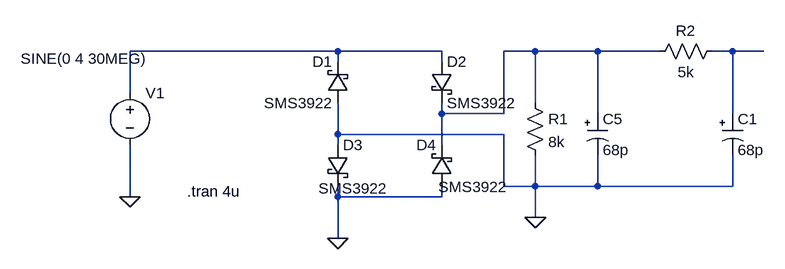
[diagram p0: schematic SQRL_Resonator_Full_Wave_Bridge_Rectifier_RF_Diode.asc]
SQRL_Resonator_Full_Wave_Bridge_Rectifier_RF_Diode.asc, the LTspice schematic file:
Version 4
SHEET 1 1288 680
WIRE 624 32 304 32
WIRE 784 32 624 32
WIRE 928 32 880 32
WIRE 1024 32 928 32
WIRE 1120 32 1024 32
WIRE 1232 32 1200 32
WIRE 1280 32 1232 32
WIRE 624 48 624 32
WIRE 784 48 784 32
WIRE 304 96 304 32
WIRE 928 112 928 32
WIRE 784 128 784 112
WIRE 880 128 880 32
WIRE 880 128 784 128
WIRE 1024 128 1024 32
WIRE 1232 128 1232 32
WIRE 624 160 624 112
WIRE 880 160 624 160
WIRE 624 176 624 160
WIRE 784 176 784 128
WIRE 880 240 880 160
WIRE 928 240 928 192
WIRE 928 240 880 240
WIRE 1024 240 1024 192
WIRE 1024 240 928 240
WIRE 1232 240 1232 192
WIRE 1232 240 1024 240
WIRE 304 256 304 176
WIRE 624 256 624 240
WIRE 784 256 784 240
WIRE 784 256 624 256
WIRE 928 288 928 240
WIRE 624 320 624 256
FLAG 304 256 0
FLAG 928 288 0
FLAG 624 320 0
SYMBOL voltage 304 80 R0
WINDOW 3 -168 -37 Left 2
WINDOW 123 24 124 Left 2
WINDOW 39 0 0 Left 0
SYMATTR Value SINE(0 4 30MEG)
SYMATTR InstName V1
SYMBOL res 912 96 R0
SYMATTR InstName R1
SYMATTR Value 8k
SYMBOL polcap 1008 128 R0
WINDOW 3 24 56 Left 2
SYMATTR Value 68p
SYMATTR InstName C5
SYMATTR Description Capacitor
SYMATTR Type cap
SYMATTR SpiceLine V=16 Irms=35m Rser=1.9518 Lser=4.16n
SYMBOL schottky 640 112 R180
WINDOW 0 24 64 Left 2
WINDOW 3 24 0 Left 2
SYMATTR InstName D1
SYMATTR Value SMS3922
SYMATTR Description Diode
SYMATTR Type diode
SYMBOL schottky 768 48 R0
SYMATTR InstName D2
SYMATTR Value SMS3922
SYMATTR Description Diode
SYMATTR Type diode
SYMBOL schottky 608 176 R0
WINDOW 3 171 65 Left 2
SYMATTR Value SMS3922
SYMATTR InstName D3
SYMATTR Description Diode
SYMATTR Type diode
SYMBOL schottky 800 240 R180
WINDOW 0 24 64 Left 2
WINDOW 3 100 -3 Left 2
SYMATTR InstName D4
SYMATTR Value SMS3922
SYMATTR Description Diode
SYMATTR Type diode
SYMBOL res 1216 16 R90
WINDOW 0 0 56 VBottom 2
WINDOW 3 32 56 VTop 2
SYMATTR InstName R2
SYMATTR Value 5k
SYMBOL polcap 1216 128 R0
WINDOW 3 24 56 Left 2
SYMATTR Value 68p
SYMATTR InstName C1
SYMATTR Description Capacitor
SYMATTR Type cap
SYMATTR SpiceLine V=16 Irms=35m Rser=1.9518 Lser=4.16n
TEXT 392 248 Left 2 !.tran 4u

The netlist it stands for:
* SQRL_Resonator_Full_Wave_Bridge_Rectifier_RF_Diode.asc
V1 N001 0 SINE(0 4 30MEG)
R1 N002 0 8k
C5 N002 0 68p V=16 Irms=35m Rser=1.9518 Lser=4.16n
D1 0 N001 SMS3922
D2 N001 N002 SMS3922
D3 0 0 SMS3922
D4 0 N002 SMS3922
R2 N003 N002 5k
C1 N003 0 68p V=16 Irms=35m Rser=1.9518 Lser=4.16n
.model D D
.lib standard.dio
.tran 4u
.backanno
.end